# EAGLE schematic DS_MASK (EAGLE 7.6.0)
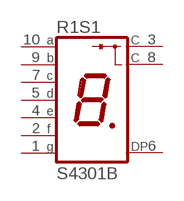
[diagram p0: schematic, sheet 1]

## Parts
R1S1  S4301B  [S4301B]
Unconnected: R1S1.1(G) R1S1.2(F) R1S1.3(C) R1S1.4(E) R1S1.5(D) R1S1.6(DP) R1S1.7(C) R1S1.8(C) R1S1.9(B) R1S1.10(A)

## Library data of the parts
R1S1 = led-7-segment:S4301B: Single Digit Seven-Segment Display (cathode common) Source: LITEON .. S4301B.pdf